# Altium schematic sheet FLASH.SchDoc
size A4
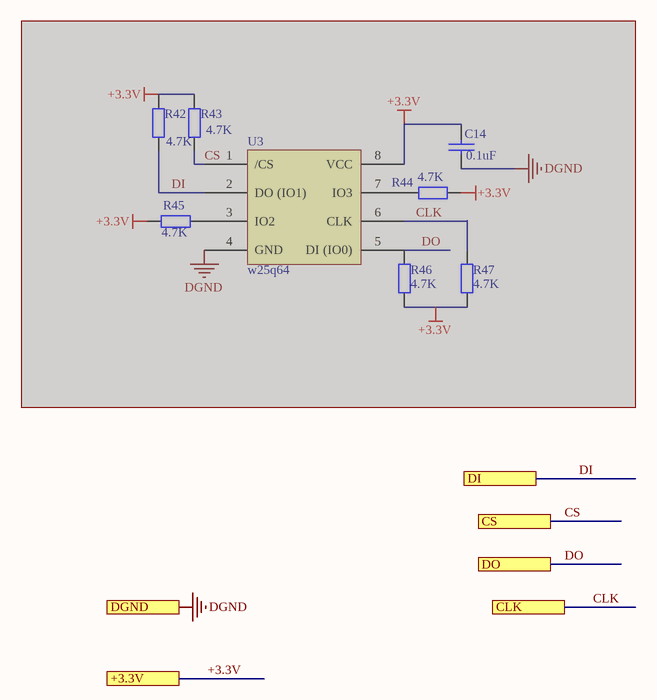
[diagram p0: FLASH.SchDoc]

## Parts
C14  0.1uF  [0805C]  (masked out: inside a compile mask, not in the netlist)
R42  4.7K  [0805R]  (masked out: inside a compile mask, not in the netlist)
R43  4.7K  [0805R]  (masked out: inside a compile mask, not in the netlist)
R44  4.7K  [0805R]  (masked out: inside a compile mask, not in the netlist)
R45  4.7K  [0805R]  (masked out: inside a compile mask, not in the netlist)
R46  4.7K  [0805R]  (masked out: inside a compile mask, not in the netlist)
R47  4.7K  [0805R]  (masked out: inside a compile mask, not in the netlist)
U3  w25q64  [W25Q64]  (masked out: inside a compile mask, not in the netlist)

## Ports
+3.3V, CLK, CS, DGND, DI, DO

## Nets
DGND: port DGND
+3.3V: port +3.3V
CLK: port CLK
CS: port CS
DI: port DI
DO: port DO

## Library data of the parts
C14 = CAP_3: 品牌： SAMSUNG(三星) 型号： CL21B104KBCNNNC ：容值：100nF 精度：±10% 额定电压：50V 材质(温度系数)：X7R 材质:X7R
R42-R47 = RES2: 品牌： UNI-ROYAL(厚声) 型号： 0805W8F3301T5E  电阻类型：厚膜电阻 阻值：3.3kΩ 精度：±1% 功率：125mW 温度系数：±100ppm/℃; Manufacturer: Generic Components; Class: Passive; SubClass: Resistor; Published: 08/06/2000; Publisher: Altium Hobart Technology Centre
U3 = w25q64: 品牌： WINBOND(华邦)   型号： W25Q64JVSSIM